# EasyEDA schematic SMT-PBTS.json
TITLE: BT Board; REV: 3.0; Date: 2023-01-10; Sheet: 4/4; Drawn By: Goose; Company: DaGoose
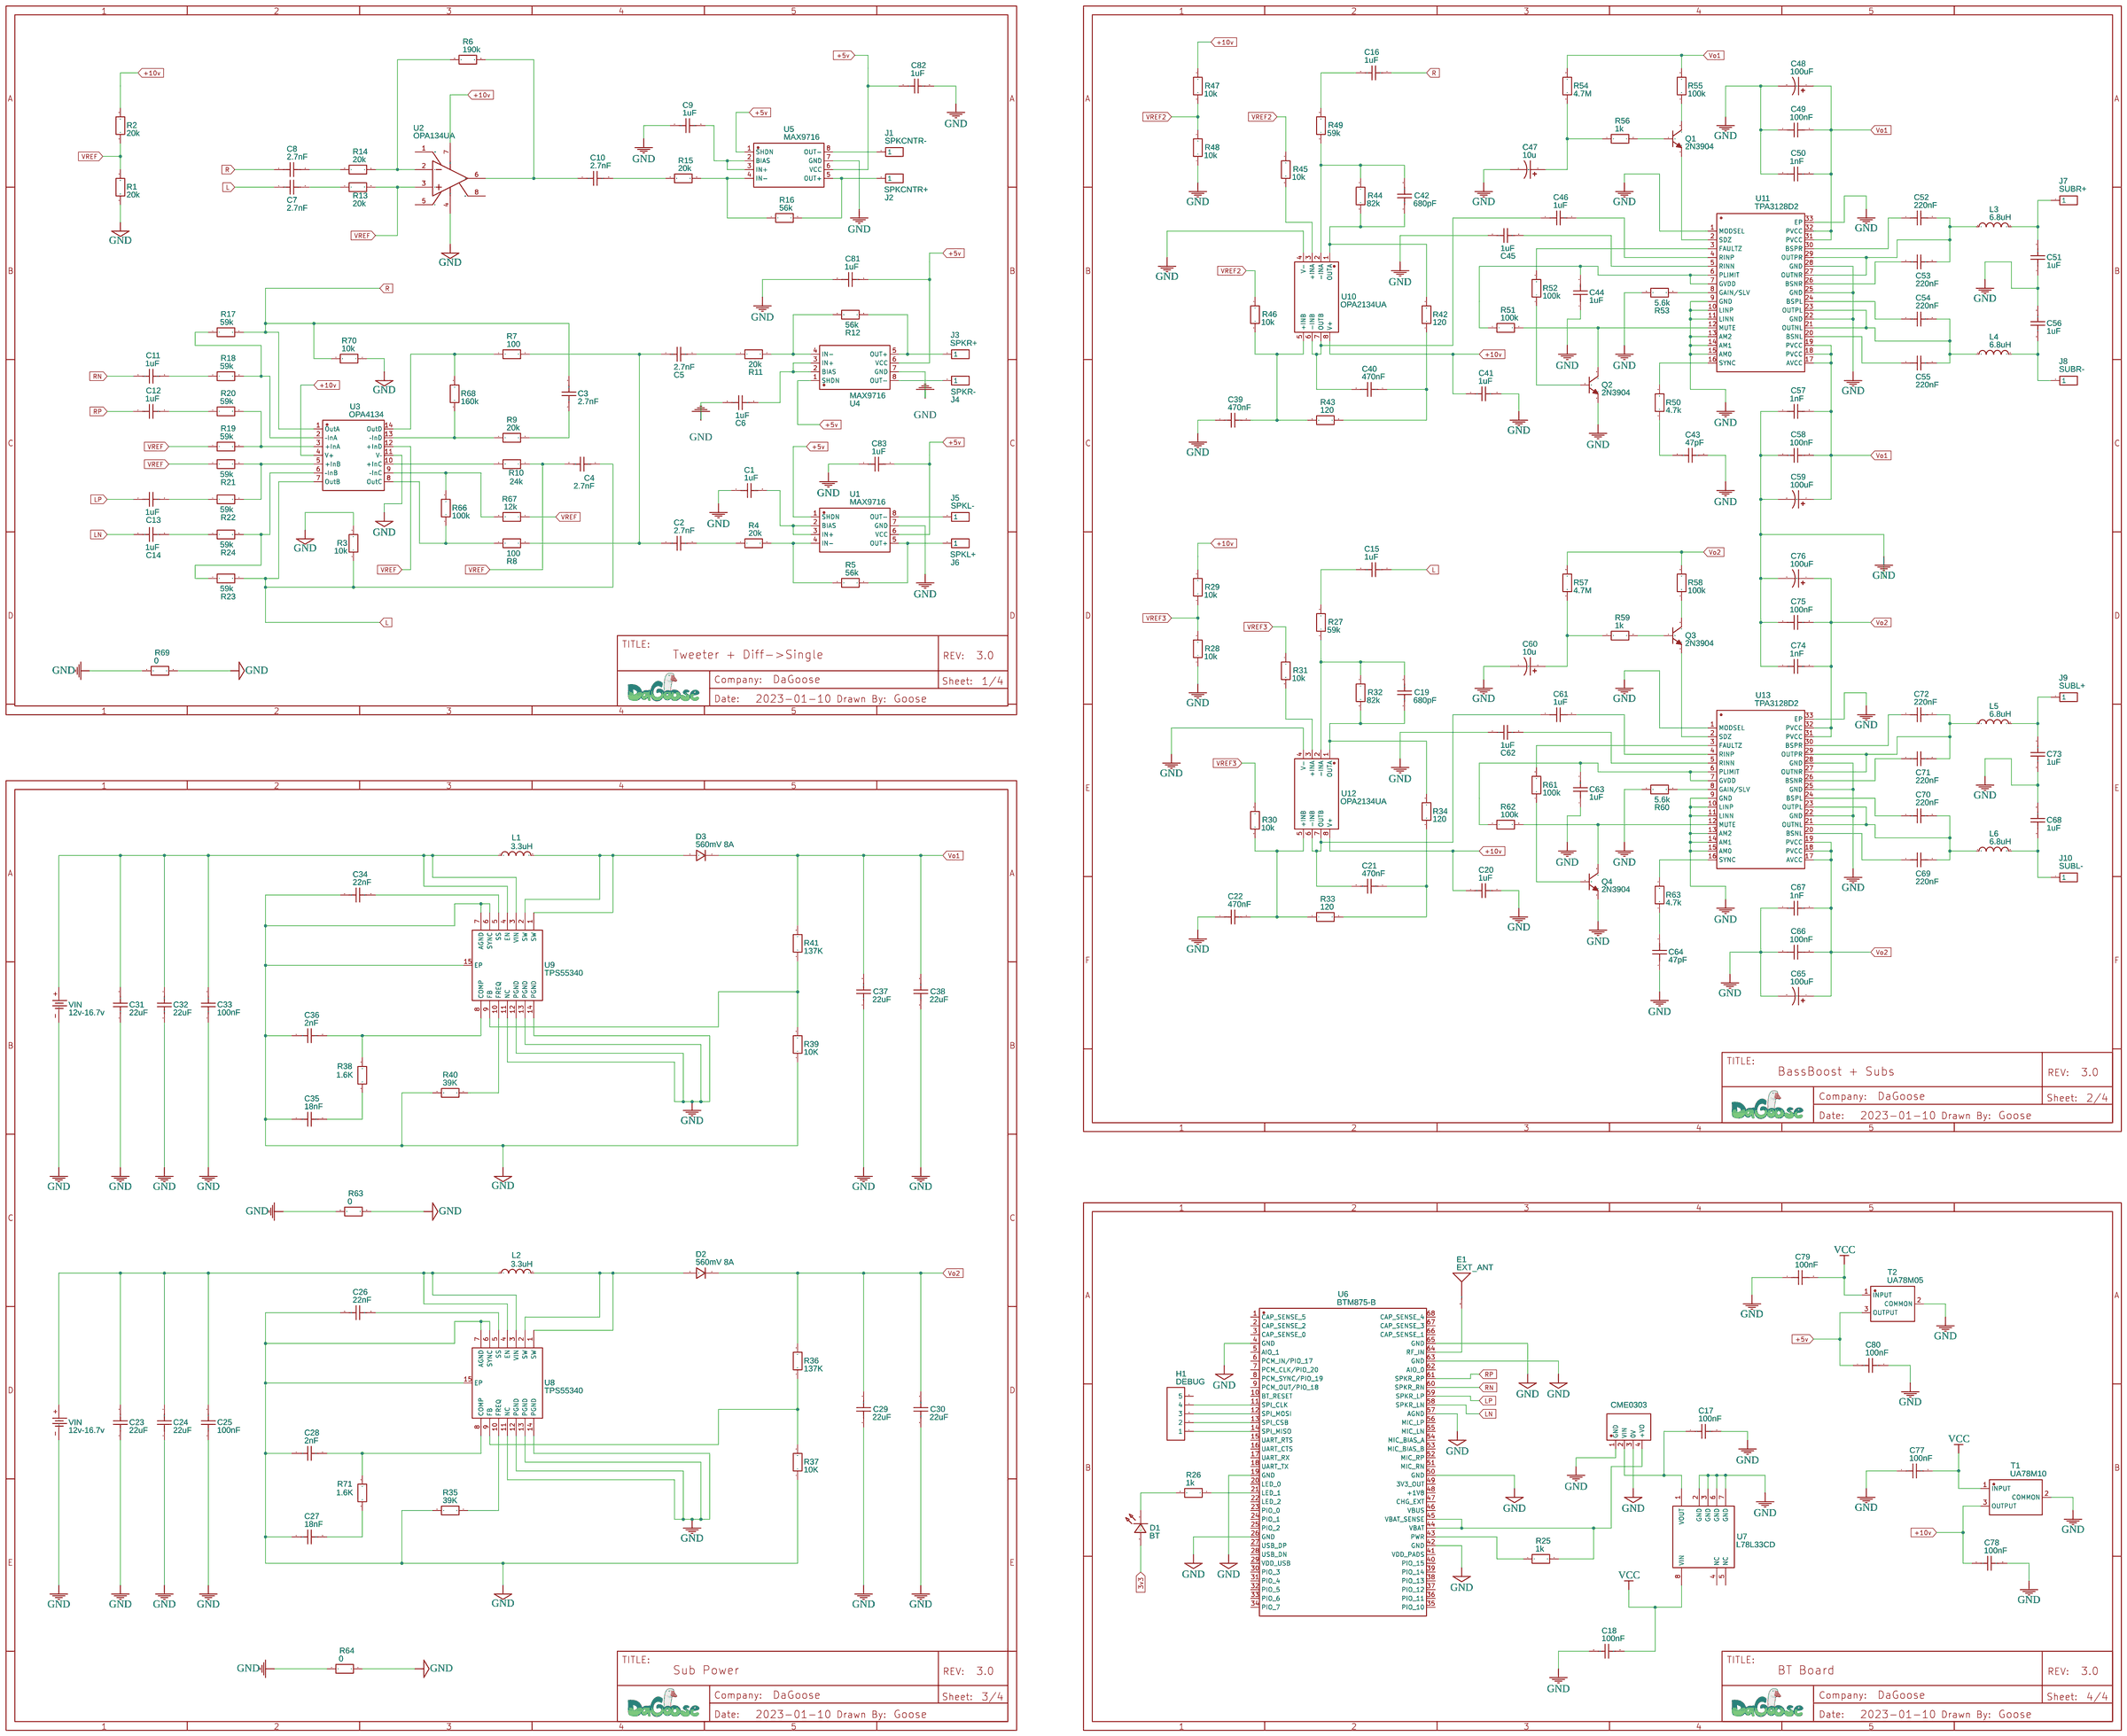
[diagram p0: schematic sheet]

## Parts
C1  1uF  [C0603]
C2  2.7nF  [C0603]
C3  2.7nF  [C0603]
C4  2.7nF  [C0603]
C5  2.7nF  [C0603]
C6  1uF  [C0603]
C7  2.7nF  [C0603]
C8  2.7nF  [C0603]
C9  1uF  [C0603]
C10  2.7nF  [C0603]
C11  1uF  [C0603]
C12  1uF  [C0603]
C13  1uF  [C0603]
C14  1uF  [C0603]
C15  1uF  [C0603]
C16  1uF  [C0603]
C17  100nF  [C0603]
C18  100nF  [C0603]
C19  680pF  [C0603]
C20  1uF  [C0603]
C21  470nF  [C0603]
C22  470nF  [C0603]
C23  22uF  [C0603]
C24  22uF  [C0603]
C25  100nF  [C0603]
C26  22nF  [C0603]
C27  18nF  [C0603]
C28  2nF  [C0603]
C29  22uF  [C0603]
C30  22uF  [C0603]
C31  22uF  [C0603]
C32  22uF  [C0603]
C33  100nF  [C0603]
C34  22nF  [C0603]
C35  18nF  [C0603]
C36  2nF  [C0603]
C37  22uF  [C0603]
C38  22uF  [C0603]
C39  470nF  [C0603]
C40  470nF  [C0603]
C41  1uF  [C0603]
C42  680pF  [C0603]
C43  47pF  [C0603]
C44  1uF  [C0603]
C45  1uF  [C0603]
C46  1uF  [C0603]
C47  10u  [CASE-A_3216]
C48  100uF  [CASE-A_3216]
C49  100nF  [C0603]
C50  1nF  [C0603]
C51  1uF  [C0603]
C52  220nF  [C0603]
C53  220nF  [C0603]
C54  220nF  [C0603]
C55  220nF  [C0603]
C56  1uF  [C0603]
C57  1nF  [C0603]
C58  100nF  [C0603]
C59  100uF  [CASE-A_3216]
C60  10u  [CASE-A_3216]
C61  1uF  [C0603]
C62  1uF  [C0603]
C63  1uF  [C0603]
C64  47pF  [C0603]
C65  100uF  [CASE-A_3216]
C66  100nF  [C0603]
C67  1nF  [C0603]
C68  1uF  [C0603]
C69  220nF  [C0603]
C70  220nF  [C0603]
C71  220nF  [C0603]
C72  220nF  [C0603]
C73  1uF  [C0603]
C74  1nF  [C0603]
C75  100nF  [C0603]
C76  100uF  [CASE-A_3216]
C77  100nF  [C0603]
C78  100nF  [C0603]
C79  100nF  [C0603]
C80  100nF  [C0603]
C81  1uF  [C0603]
C82  1uF  [C0603]
C83  1uF  [C0603]
D1  BT  [LED0603_RED]
D2  560mV 8A  [DO-41_BD2.4-L4.7-P8.70-D0.9-RD]
D3  560mV 8A  [DO-41_BD2.4-L4.7-P8.70-D0.9-RD]
E1  EXT_ANT  [ANTENNA-CHIP3]
H1  DEBUG  [HDR-F-2.54_1X5]
J1  SPKCNTR-  [HDR-M-2.54_1X1]
J2  SPKCNTR+  [HDR-M-2.54_1X1]
J3  SPKR+  [HDR-M-2.54_1X1]
J4  SPKR-  [HDR-M-2.54_1X1]
J5  SPKL-  [HDR-M-2.54_1X1]
J6  SPKL+  [HDR-M-2.54_1X1]
J7  SUBR+  [HDR-M-2.54_1X1]
J8  SUBR-  [HDR-M-2.54_1X1]
J9  SUBL+  [HDR-M-2.54_1X1]
J10  SUBL-  [HDR-M-2.54_1X1]
L1  3.3uH  [L0603]
L2  3.3uH  [L0603]
L3  6.8uH  [L0603]
L4  6.8uH  [L0603]
L5  6.8uH  [L0603]
L6  6.8uH  [L0603]
Q1  2N3904  [SOT-23-3_L2.9-W1.3-P1.90-LS2.4-TR]
Q2  2N3904  [SOT-23-3_L2.9-W1.3-P1.90-LS2.4-TR]
Q3  2N3904  [SOT-23-3_L2.9-W1.3-P1.90-LS2.4-TR]
Q4  2N3904  [SOT-23-3_L2.9-W1.3-P1.90-LS2.4-TR]
R1  20k  [R0603]
R2  20k  [R0603]
R3  10k  [R0603]
R4  20k  [R0603]
R5  56k  [R0603]
R6  190k  [R0603]
R7  100  [R0603]
R8  100  [R0603]
R9  20k  [R0603]
R10  24k  [R0603]
R11  20k  [R0603]
R12  56k  [R0603]
R13  20k  [R0603]
R14  20k  [R0603]
R15  20k  [R0603]
R16  56k  [R0603]
R17  59k  [R0603]
R18  59k  [R0603]
R19  59k  [R0603]
R20  59k  [R0603]
R21  59k  [R0603]
R22  59k  [R0603]
R23  59k  [R0603]
R24  59k  [R0603]
R25  1k  [R0603]
R26  1k  [R0603]
R27  59k  [R0603]
R28  10k  [R0603]
R29  10k  [R0603]
R30  10k  [R0603]
R31  10k  [R0603]
R32  82k  [R0603]
R33  120  [R0603]
R34  120  [R0603]
R35  39K  [R0603]
R36  137K  [R0603]
R37  10K  [R0603]
R38  1.6K  [R0603]
R39  10K  [R0603]
R40  39K  [R0603]
R41  137K  [R0603]
R42  120  [R0603]
R43  120  [R0603]
R44  82k  [R0603]
R45  10k  [R0603]
R46  10k  [R0603]
R47  10k  [R0603]
R48  10k  [R0603]
R49  59k  [R0603]
R50  4.7k  [R0603]
R51  100k  [R0603]
R52  100k  [R0603]
R53  5.6k  [R0603]
R54  4.7M  [R0603]
R55  100k  [R0603]
R56  1k  [R0603]
R57  4.7M  [R0603]
R58  100k  [R0603]
R59  1k  [R0603]
R60  5.6k  [R0603]
R61  100k  [R0603]
R62  100k  [R0603]
R63  4.7k  [R0603]
R63#2  0  [R0603]
R64  0  [R0603]
R66  100k  [R0603]
R67  12k  [R0603]
R68  160k  [R0603]
R69  0  [R0603]
R70  10k  [R0603]
R71  1.6K  [R0603]
T1  UA78M10  [TO-252-3_L6.5-W6.1-P4.58-TL]
T2  UA78M05  [TO-252-3_L6.5-W6.1-P4.58-TL]
U1  MAX9716  [SOIC-8_L4.9-W3.9-P1.27-LS6.0-BL]
U2  OPA134UA  [SOIC-8_L4.9-W3.9-P1.27-LS6.0-BL]
U3  OPA4134  [SOIC-14_L8.7-W3.9-P1.27-LS6.0-BL]
U4  MAX9716  [SOIC-8_L4.9-W3.9-P1.27-LS6.0-BL]
U5  MAX9716  [SOIC-8_L4.9-W3.9-P1.27-LS6.0-BL]
U6  BTM875-B  [SMD-68_L22.0-W15.0-P1.00-LB-SJR-BTM875-B]
U7  L78L33CD  [SOIC8]
U8  TPS55340  [HTSSOP-14_L5.0-W4.4-P0.65-LS6.4-BL-EP]
U9  TPS55340  [HTSSOP-14_L5.0-W4.4-P0.65-LS6.4-BL-EP]
U10  OPA2134UA  [SOIC-8_L4.9-W3.9-P1.27-LS6.0-BL]
U11  TPA3128D2  [HTSSOP-32_L11.0-W6.1-P0.65-LS8.1-BL-EP]
U12  OPA2134UA  [SOIC-8_L4.9-W3.9-P1.27-LS6.0-BL]
U13  TPA3128D2  [HTSSOP-32_L11.0-W6.1-P0.65-LS8.1-BL-EP]
U19  CME0303  [PWRM-TH_B0505S-1W]
VIN  12v-16.7v  [BAT-SMD_CR1220-2]
VIN#2  12v-16.7v  [BAT-SMD_CR1220-2]

## Library data of the parts
C1-C46 C49-C58 C61-C64 C66-C75 C77-C83 = C_0603_US: Contributor: LCEDA_Lib
C47 C48 C59 C60 C65 C76 = C_Tan_SMD_A_US: Contributor: LCEDA_Lib
D1 = LED-0603_R: Manufacturer: EVERLIGHT(台湾亿光); Manufacturer Part: 19-217/R6C-AL1M2VY/3T; Supplier Part: C72044; Supplier: LCSC; Contributor: LCEDA_01
D2 D3 = 1N4007: Supplier: LCSC; Manufacturer: SEMTECH; Supplier Part: C106903; Contributor: LCEDA_Lib
E1 = ANTENNA2: Contributor: SparkFun
H1 = HDR-F-2.54_1x5: Supplier Part: C50950; Supplier: LCSC; Contributor: LCEDA_Lib
J1-J10 = HDR-M-2.54_1x1: Supplier Part: C81276; Supplier: LCSC; Contributor: LCEDA_Lib
L1-L6 = L0603_US: Contributor: LCEDA_Lib
Q1-Q4 = 2N3904(SOT-23): Supplier: LCSC; Manufacturer: KEC; Manufacturer Part: 2n3904S-RTK/PS; Supplier Part: C18536; Paste Type: SOT-23; Contributor: LCEDA_Lib
R1-R63 R63#2 R64 R66-R71 = R_0603_EU: Contributor: LCEDA_Lib
T1 = UA78M10CKVURG3: Supplier: LCSC; Supplier Part: C2868719; Manufacturer: TI(德州仪器); link: https://atta.szlcsc.comnull; Contributor: LCSC
T2 = UA78M05CKVURG3: Supplier: LCSC; Supplier Part: C2867088; Manufacturer: TI(德州仪器); link: https://atta.szlcsc.comnull; Contributor: LCSC
U1 U4 U5 = MAX9716: Supplier: Mouser; Manufacturer Part: MAX9716EUA+T; Contributor: DaGoose
U2 = OPA134UA: Supplier: LCSC; Supplier Part: C86716; Manufacturer: TI(德州仪器); Contributor: LCSC; JLCPCB Part Class: Extended Part
U3 = OPA4134UA: Supplier: LCSC; Supplier Part: C2832240; Manufacturer: TI(德州仪器); JLCPCB Part Class: Extended Part; Contributor: LCSC
U6 = SJR-BTM875-B: Supplier: LCSC; Supplier Part: C2764999; Manufacturer: null; Contributor: LCSC; JLCPCB Part Class: Extended Part
U7 = L78L33CD-TR: Positive Voltage Regulator, 3.3V, 8-Pin SO, Tape and Reel
U8 U9 = TPS55340PWPR: Supplier: LCSC; Manufacturer: TI(德州仪器); Supplier Part: C43862; JLCPCB Part Class: Extended Part
U10 U12 = OPA2134UA/2K5: Supplier: LCSC; Manufacturer: TI(德州仪器); Contributor: LCSC; Supplier Part: C87361; JLCPCB Part Class: Extended Part
U11 U13 = TPA3128D2DAPR: Supplier: LCSC; Supplier Part: C473362; Manufacturer: Texas Instruments; Contributor: LCSC; JLCPCB Part Class: Extended Part
U19 = B0505S-1W_C2912568: Supplier: LCSC; Supplier Part: C2912568; Manufacturer: DEXU(德旭电子); Manufacturer Part: B0505S-1W; Contributor: LCSC; JLCPCB Part Class: Extended Part
VIN VIN#2 = CR1220-2: Supplier: LCSC; Manufacturer: Q&J; image: //image.lceda.cn/szlcsc/C70381.jpg; Supplier Part: C70381

## Nets
3v3: D1.1
+5v: C80.1 C81.2 C82.1 C83.2 T2.3(OUTPUT) U1.1(SHDN) U1.6(VCC) U4.1(SHDN) U4.6(VCC) U5.1(SHDN) U5.6(VCC)
+10v: C20.1 C41.1 C78.1 R2.2 R29.2 R47.2 T1.3(OUTPUT) U2.7(V+) U3.4(V+) U10.8(V+) U12.8(V+)
GND: C1.1 C6.1 C9.1 C17.2 C18.1 C20.2 C22.1 C23.1 C24.1 C25.1 C26.1 C27.1 C28.1 C29.1 C30.1 C31.1 C32.1 C33.1 C34.1 C35.1 C36.1 C37.1 C38.1 C39.1 C41.2 C43.2 C44.1 C45.1 C47.2 C48.2 C49.1 C50.1 C51.1 C56.2 C57.1 C58.1 C59.2 C60.2 C62.1 C63.1 C64.1 C65.2 C66.1 C67.1 C68.2 C73.1 C74.1 C75.1 C76.2 C77.1 C78.2 C79.1 C80.2 C81.1 C82.2 C83.1 Q2.1(E) Q4.1(E) R1.2 R3.2 R28.1 R35.2 R37.1 R39.1 R40.2 R48.1 R53.1 R60.1 R63#2.1 R63#2.2 R64.1 R64.2 R69.1 R69.2 R70.1 T1.2(COMMON) T2.2(COMMON) U1.7(GND) U2.4(V-) U3.11(V–) U4.7(GND) U5.7(GND) U6.4(GND) U6.19(GND) U6.26(GND) U6.42(GND) U6.50(GND) U6.57(AGND) U6.63(GND) U6.65(GND) U7.2(GND) U7.3(GND) U7.6(GND) U7.7(GND) U8.6(SYNC) U8.7(AGND) U8.11(NC) U8.12(PGND) U8.13(PGND) U8.14(PGND) U8.15(EP) U9.6(SYNC) U9.7(AGND) U9.11(NC) U9.12(PGND) U9.13(PGND) U9.14(PGND) U9.15(EP) U10.4(V-) U11.1(MODSEL) U11.9(GND) U11.10(LINP) U11.11(LINN) U11.13(AM2) U11.14(AM1) U11.15(AM0) U11.22(GND) U11.25(GND) U11.28(GND) U11.33(EP) U12.4(V-) U13.1(MODSEL) U13.9(GND) U13.10(LINP) U13.11(LINN) U13.13(AM2) U13.14(AM1) U13.15(AM0) U13.22(GND) U13.25(GND) U13.28(GND) U13.33(EP) U19.1(GND) U19.3(0V) VIN.-(2) VIN#2.-(2)
VCC: C18.2 C77.2 C79.2 T1.1(INPUT) T2.1(INPUT) U7.8(VIN)
L: C4.1 C7.1 C15.1 R3.1 R23.2 U3.7(OutB)
LN: C14.1 U6.58(SPKR_LN)
LP: C13.1 U6.59(SPKR_LP)
R: C3.2 C8.1 C16.1 R17.2 R70.2 U3.1(OutA)
RN: C11.1 U6.60(SPKR_RN)
RP: C12.1 U6.61(SPKR_RP)
Vo1: C37.2 C38.2 C48.1 C49.2 C50.2 C57.2 C58.2 C59.1 D3.1 R41.2 R54.2 R55.2 U11.17(AVCC) U11.18(PVCC) U11.19(PVCC) U11.31(PVCC) U11.32(PVCC)
Vo2: C29.2 C30.2 C65.1 C66.2 C67.2 C74.2 C75.2 C76.1 D2.1 R36.2 R57.2 R58.2 U13.17(AVCC) U13.18(PVCC) U13.19(PVCC) U13.31(PVCC) U13.32(PVCC)
VREF: C4.2 R1.1 R2.1 R10.1 R13.2 R19.1 R21.1 R67.1 U2.3(IN+) U3.12(+InD)
VREF2: R45.1 R46.1 R47.1 R48.2
VREF3: R28.2 R29.1 R30.1 R31.1
Net-(C1-2): C1.2 U1.2(BIAS) U1.3(IN+)
Net-(C2-1): C2.1 C5.1 R7.2 R8.2
Net-(C2-2): C2.2 R4.1
Net-(C3-1): C3.1 R9.2
Net-(C5-2): C5.2 R11.1
Net-(C6-2): C6.2 U4.2(BIAS) U4.3(IN+)
Net-(C7-2): C7.2 R13.1
Net-(C8-2): C8.2 R14.1
Net-(C9-2): C9.2 U5.2(BIAS) U5.3(IN+)
Net-(C10-1): C10.1 R6.2 U2.6(OUT)
Net-(C10-2): C10.2 R15.1
Net-(C11-2): C11.2 R18.1
Net-(C12-2): C12.2 R20.1
Net-(C13-2): C13.2 R22.1
Net-(C14-2): C14.2 R24.1
Net-(C15-2): C15.2 R27.2
Net-(C16-2): C16.2 R49.2
Net-(C17-1): C17.1 U7.1(VOUT) U19.2(VIN)
Net-(C19-1): C19.1 R32.2 R34.2 U12.1(OUTA)
Net-(C19-2): C19.2 R27.1 R32.1 U12.2(-INA)
Net-(C21-1): C21.1 R33.2 R34.1
Net-(C21-2): C21.2 C61.1 U12.6(-INB) U12.7(OUTB)
Net-(C22-2): C22.2 R30.2 R33.1 U12.5(+INB)
Net-(C23-2): C23.2 C24.2 C25.2 L2.1 U8.3(VIN) U8.4(EN) VIN#2.+(1)
Net-(C26-2): C26.2 U8.5(SS)
Net-(C27-2): C27.2 R71.1
Net-(C28-2): C28.2 R71.2 U8.8(COMP)
Net-(C31-2): C31.2 C32.2 C33.2 L1.1 U9.3(VIN) U9.4(EN) VIN.+(1)
Net-(C34-2): C34.2 U9.5(SS)
Net-(C35-2): C35.2 R38.1
Net-(C36-2): C36.2 R38.2 U9.8(COMP)
Net-(C39-2): C39.2 R43.1 R46.2 U10.5(+INB)
Net-(C40-1): C40.1 R42.1 R43.2
Net-(C40-2): C40.2 C46.1 U10.6(-INB) U10.7(OUTB)
Net-(C42-1): C42.1 R42.2 R44.2 U10.1(OUTA)
Net-(C42-2): C42.2 R44.1 R49.1 U10.2(-INA)
Net-(C43-1): C43.1 R50.1
Net-(C44-2): C44.2 R51.1 U11.6(PLIMIT) U11.7(GVDD)
Net-(C45-2): C45.2 U11.5(RINN)
Net-(C46-2): C46.2 U11.4(RINP)
Net-(C47-1): C47.1 R54.1 R56.1
Net-(C51-2): C51.2 J7.1 L3.2
Net-(C52-1): C52.1 U11.30(BSPR)
Net-(C52-2): C52.2 C53.2 L3.1 U11.27(OUTNR) U11.29(OUTPR)
Net-(C53-1): C53.1 U11.26(BSNR)
Net-(C54-1): C54.1 U11.24(BSPL)
Net-(C54-2): C54.2 C55.2 L4.1 U11.21(OUTNL) U11.23(OUTPL)
Net-(C55-1): C55.1 U11.20(BSNL)
Net-(C56-1): C56.1 J8.1 L4.2
Net-(C60-1): C60.1 R57.1 R59.1
Net-(C61-2): C61.2 U13.4(RINP)
Net-(C62-2): C62.2 U13.5(RINN)
Net-(C63-2): C63.2 R62.1 U13.6(PLIMIT) U13.7(GVDD)
Net-(C64-2): C64.2 R63.1
Net-(C68-1): C68.1 J10.1 L6.2
Net-(C69-1): C69.1 U13.20(BSNL)
Net-(C69-2): C69.2 C70.2 L6.1 U13.21(OUTNL) U13.23(OUTPL)
Net-(C70-1): C70.1 U13.24(BSPL)
Net-(C71-1): C71.1 U13.26(BSNR)
Net-(C71-2): C71.2 C72.2 L5.1 U13.27(OUTNR) U13.29(OUTPR)
Net-(C72-1): C72.1 U13.30(BSPR)
Net-(C73-2): C73.2 J9.1 L5.2
Net-(D1-2): D1.2 R26.2
Net-(D2-2): D2.2 L2.2 U8.1(SW) U8.2(SW)
Net-(D3-2): D3.2 L1.2 U9.1(SW) U9.2(SW)
Net-(E1-FEED): E1.FEED(SIGNAL) U6.64(RF_IN)
Net-(H1-1): H1.1 U6.14(SPI_MISO)
Net-(H1-2): H1.2 U6.13(SPI_CSB)
Net-(H1-3): H1.3 U6.12(SPI_MOSI)
Net-(H1-4): H1.4 U6.11(SPI_CLK)
Net-(J1-1): J1.1 U5.8(OUT-)
Net-(J2-1): J2.1 R16.2 U5.5(OUT+)
Net-(J3-1): J3.1 R12.2 U4.5(OUT+)
Net-(J4-1): J4.1 U4.8(OUT-)
Net-(J5-1): J5.1 U1.8(OUT-)
Net-(J6-1): J6.1 R5.2 U1.5(OUT+)
Net-(Q1-1): Q1.1(E) U11.2(SDZ)
Net-(Q1-2): Q1.2(B) R56.2
Net-(Q1-3): Q1.3(C) R55.1
Net-(Q2-2): Q2.2(B) R52.1
Net-(Q2-3): Q2.3(C) R51.2 U11.12(MUTE)
Net-(Q3-1): Q3.1(E) U13.2(SDZ)
Net-(Q3-2): Q3.2(B) R59.2
Net-(Q3-3): Q3.3(C) R58.1
Net-(Q4-2): Q4.2(B) R61.1
Net-(Q4-3): Q4.3(C) R62.2 U13.12(MUTE)
Net-(R4-2): R4.2 R5.1 U1.4(IN-)
Net-(R6-1): R6.1 R14.2 U2.2(IN-)
Net-(R7-1): R7.1 R68.2 U3.14(OutD)
Net-(R8-1): R8.1 R66.1 U3.8(OutC)
Net-(R9-1): R9.1 R68.1 U3.13(–InD)
Net-(R10-2): R10.2 U3.10(+InC)
Net-(R11-2): R11.2 R12.1 U4.4(IN-)
Net-(R15-2): R15.2 R16.1 U5.4(IN-)
Net-(R17-1): R17.1 R18.2 U3.2(–InA)
Net-(R19-2): R19.2 R20.2 U3.3(+InA)
Net-(R21-2): R21.2 R22.2 U3.5(+InB)
Net-(R23-1): R23.1 R24.2 U3.6(–InB)
Net-(R25-1): R25.1 U6.43(PWR)
Net-(R25-2): R25.2 U6.44(VBAT) U6.45(VBAT_SENSE) U19.4(+VO)
Net-(R26-1): R26.1 U6.21(LED_1)
Net-(R31-2): R31.2 U12.3(+INA)
Net-(R35-1): R35.1 U8.10(FREQ)
Net-(R36-1): R36.1 R37.2 U8.9(FB)
Net-(R39-2): R39.2 R41.1 U9.9(FB)
Net-(R40-1): R40.1 U9.10(FREQ)
Net-(R45-2): R45.2 U10.3(+INA)
Net-(R50-2): R50.2 U11.16(SYNC)
Net-(R52-2): R52.2 U11.3(FAULTZ)
Net-(R53-2): R53.2 U11.8(GAIN/SLV)
Net-(R60-2): R60.2 U13.8(GAIN/SLV)
Net-(R61-2): R61.2 U13.3(FAULTZ)
Net-(R63-2): R63.2 U13.16(SYNC)
Net-(R66-2): R66.2 R67.2 U3.9(–InC)

Not connected (* = marked no-connect by the designer): H1 5; U2 1(Offset Trim) 5(NC) 8(Offset Trim); U6 1(CAP_SENSE_5) 2(CAP_SENSE) 3(CAP_SENSE_0) 5(AIO_1) 6(PCM_IN/PIO_17) 7(PCM_CLK/PIO_20) 8(PCM_SYNC/PIO_19) 9(PCM_OUT/PIO_18) 10(BT_RESET) 15(UART_RTS) 16(UART_CTS) 17(UART_RX) 18(UART_TX) 20(LED_0) 22(LED_2) 23(PIO_0) 24(PIO_1) 25(PIO_2) 27(USB_DP) 28(USB_DN) 29(VDD_USB) 30(PIO_3) 31(PIO_4) 32(PIO_5) 33(PIO_6) 34(PIO_7) 35(PIO_10) 36(PIO_11) 37(PIO_12) 38(PIO_13) 39(PIO_14) 40(PIO_15) 41(VDD_PADS) 46(VBUS) 47(CHG_EXT) 48(+1V8) 49(3V3_OUT) 51(MIC_RN) 52(MIC_RP) 53(MIC_BIAS_B) 54(MIC_BIAS_A) 55(MIC_LN) 56(MIC_LP) 62(AIO_0) 66(CAP_SENSE_1) 67(CAP_SENSE_3) 68(CAP_SENSE_4); U7 4(NC) 5(NC)
